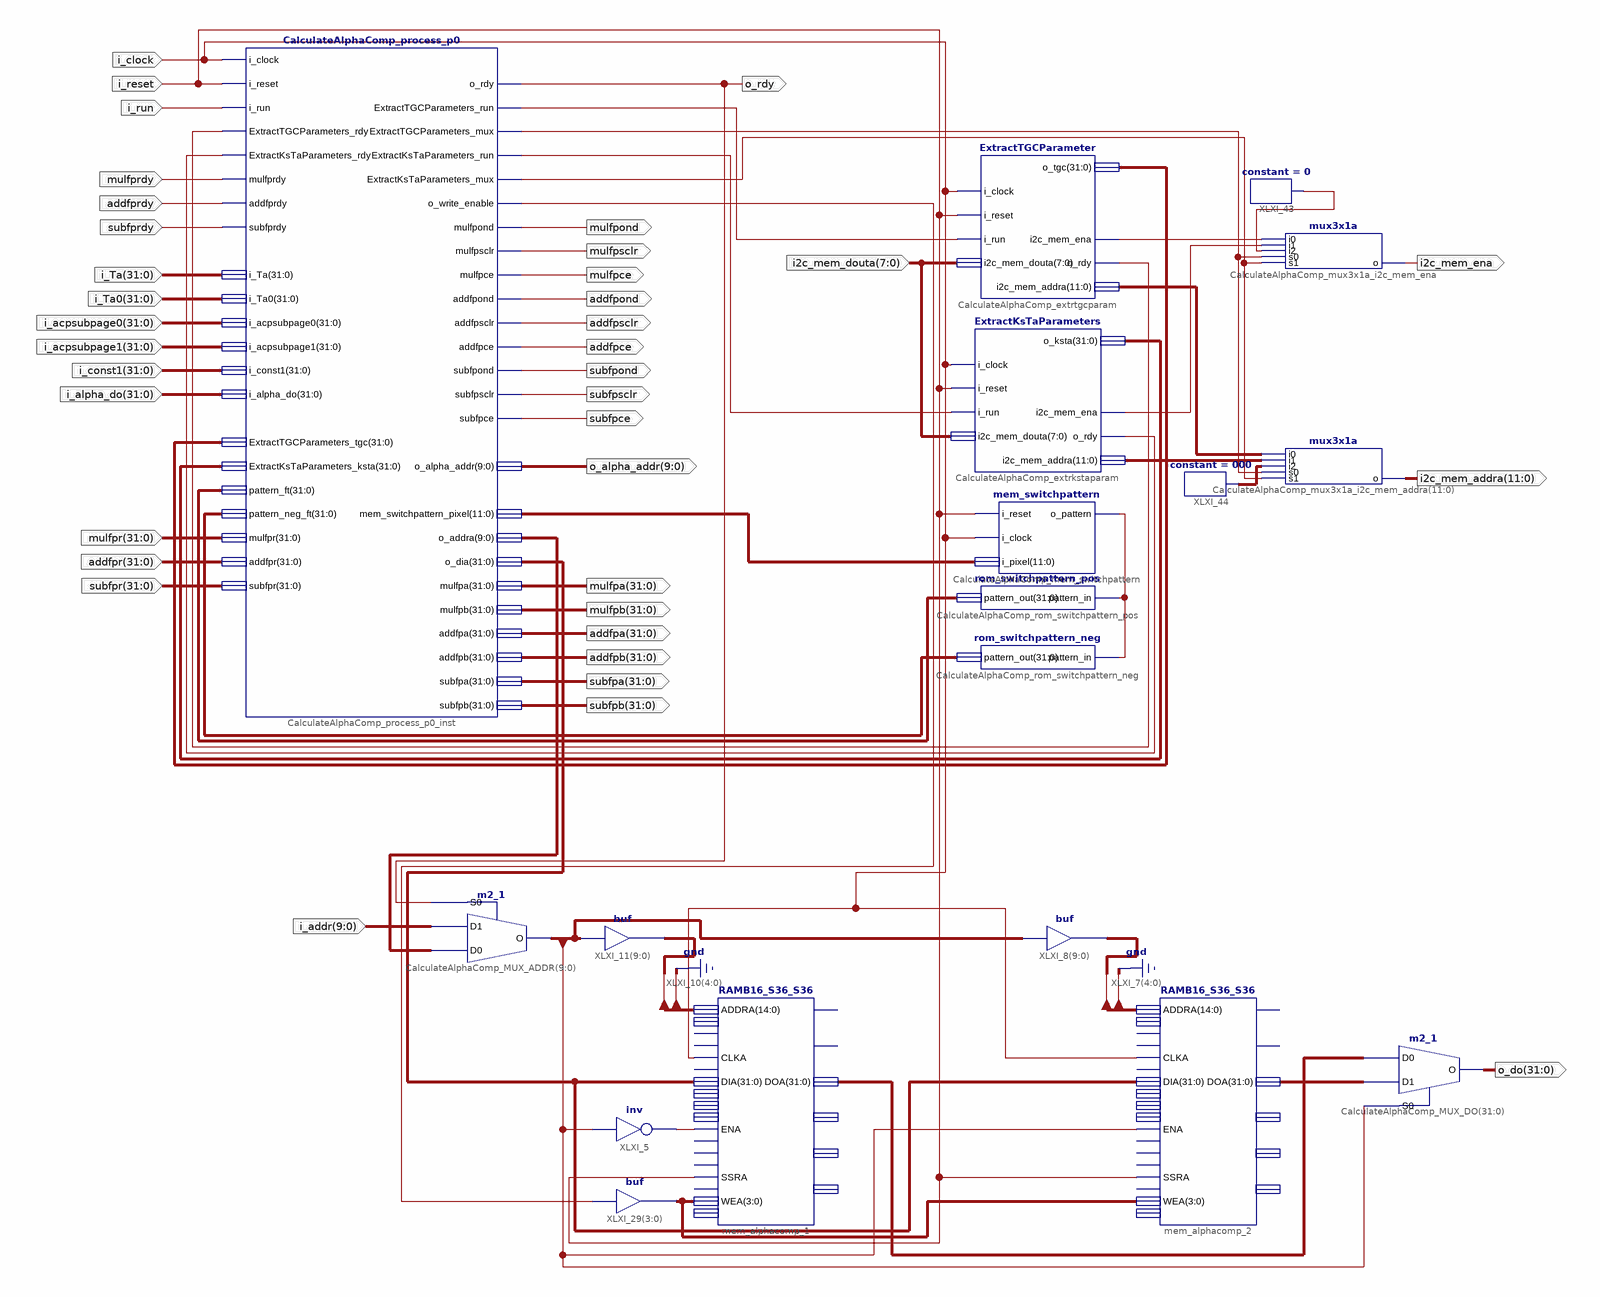
[diagram p0: schematic sheet 1]
// Xilinx ISE schematic CalculateAlphaComp.sch (spartan3e) as structural Verilog: 18 symbols, 37 ports
module CalculateAlphaComp (
  input  [9:0] i_addr,
  input  i_clock,
  input  i_reset,
  input  [7:0] i2c_mem_douta,
  input  i_run,
  input  mulfprdy,
  input  addfprdy,
  input  subfprdy,
  input  [31:0] i_Ta,
  input  [31:0] i_Ta0,
  input  [31:0] i_acpsubpage0,
  input  [31:0] i_acpsubpage1,
  input  [31:0] i_const1,
  input  [31:0] i_alpha_do,
  input  [31:0] mulfpr,
  input  [31:0] addfpr,
  input  [31:0] subfpr,
  output [31:0] o_do,
  output [11:0] i2c_mem_addra,
  output i2c_mem_ena,
  output o_rdy,
  output [31:0] subfpb,
  output [31:0] subfpa,
  output [31:0] addfpb,
  output [31:0] addfpa,
  output [31:0] mulfpb,
  output [31:0] mulfpa,
  output [9:0] o_alpha_addr,
  output subfpce,
  output subfpsclr,
  output subfpond,
  output addfpce,
  output addfpsclr,
  output addfpond,
  output mulfpce,
  output mulfpsclr,
  output mulfpond
);

  wire XLXN_59, XLXN_236, XLXN_242, XLXN_246, XLXN_247, XLXN_248, XLXN_249, XLXN_256, XLXN_257, XLXN_258,
       XLXN_259, XLXN_273;
  wire [3:0] XLXN_139;
  wire [9:0] mux_addr1, XLXN_241;
  wire [11:0] XLXN_243, XLXN_260, XLXN_261, XLXN_274;
  wire [14:5] XLXN_44, XLXN_45;
  wire [31:0] XLXN_78, XLXN_79, XLXN_239, XLXN_244, XLXN_245, XLXN_251, XLXN_253;

  assign XLXN_45 = mux_addr1;  // buf XLXI_8[9..0], 10 bits wide
  assign XLXN_44 = mux_addr1;  // buf XLXI_11[9..0], 10 bits wide
  not XLXI_5 (XLXN_59, mux_addr1[9]);
  RAMB16_S36_S36 #(.WRITE_WIDTH_B(36), .WRITE_WIDTH_A(36), .WRITE_MODE_B("READ_FIRST"), .WRITE_MODE_A("READ_FIRST"), .READ_WIDTH_B(36), .READ_WIDTH_A(36)) mem_alphacomp_1 (
    .ADDRA({XLXN_44, {5{1'b0}}}), .CLKA(i_clock), .DIA(XLXN_239), .ENA(XLXN_59), .SSRA(i_reset),
    .WEA(XLXN_139), .DOA(XLXN_79));  // open: ADDRB, CASCADEINA, CASCADEINB, CLKB, DIB, DIPA, DIPB, REGCEA, REGCEB, ENB, SSRB, WEB, CASCADEOUTA, CASCADEOUTB, DOB, DOPA, DOPB
  m2_1 CalculateAlphaComp_MUX_DO[31:0] (.D0(XLXN_79), .D1(XLXN_78), .S0(mux_addr1[9]), .O(o_do));
  assign XLXN_139 = {4{XLXN_236}};  // buf XLXI_29[3..0], 4 bits wide
  m2_1 CalculateAlphaComp_MUX_ADDR[9:0] (.D0(XLXN_241), .D1(i_addr), .S0(o_rdy), .O(mux_addr1));
  RAMB16_S36_S36 #(.WRITE_WIDTH_B(36), .WRITE_WIDTH_A(36), .WRITE_MODE_B("READ_FIRST"), .WRITE_MODE_A("READ_FIRST"), .READ_WIDTH_B(36), .READ_WIDTH_A(36)) mem_alphacomp_2 (
    .ADDRA({XLXN_45, {5{1'b0}}}), .CLKA(i_clock), .DIA(XLXN_239), .ENA(mux_addr1[9]), .SSRA(i_reset),
    .WEA(XLXN_139), .DOA(XLXN_78));  // open: ADDRB, CASCADEINA, CASCADEINB, CLKB, DIB, DIPA, DIPB, REGCEA, REGCEB, ENB, SSRB, WEB, CASCADEOUTA, CASCADEOUTB, DOB, DOPA, DOPB
  mem_switchpattern CalculateAlphaComp_mem_switchpattern (
    .i_reset(i_reset), .i_clock(i_clock), .i_pixel(XLXN_243), .o_pattern(XLXN_242));
  ExtractKsTaParameters CalculateAlphaComp_extrkstaparam (
    .i_clock(i_clock), .i_reset(i_reset), .o_ksta(XLXN_253), .i_run(XLXN_247), .i2c_mem_douta(i2c_mem_douta),
    .i2c_mem_ena(XLXN_257), .o_rdy(XLXN_249), .i2c_mem_addra(XLXN_260));
  ExtractTGCParameter CalculateAlphaComp_extrtgcparam (
    .i_clock(i_clock), .i_reset(i_reset), .o_tgc(XLXN_251), .i_run(XLXN_246), .i2c_mem_douta(i2c_mem_douta),
    .i2c_mem_ena(XLXN_256), .o_rdy(XLXN_248), .i2c_mem_addra(XLXN_261));
  rom_switchpattern_neg CalculateAlphaComp_rom_switchpattern_neg (.pattern_in(XLXN_242), .pattern_out(XLXN_245));
  rom_switchpattern_pos CalculateAlphaComp_rom_switchpattern_pos (.pattern_in(XLXN_242), .pattern_out(XLXN_244));
  CalculateAlphaComp_process_p0 CalculateAlphaComp_process_p0_inst (
    .i_clock(i_clock), .i_reset(i_reset), .i_run(i_run), .ExtractTGCParameters_rdy(XLXN_248),
    .ExtractKsTaParameters_rdy(XLXN_249), .mulfprdy(mulfprdy), .addfprdy(addfprdy), .subfprdy(subfprdy),
    .i_Ta(i_Ta), .i_Ta0(i_Ta0), .i_acpsubpage0(i_acpsubpage0), .i_acpsubpage1(i_acpsubpage1),
    .i_const1(i_const1), .i_alpha_do(i_alpha_do), .ExtractTGCParameters_tgc(XLXN_251),
    .ExtractKsTaParameters_ksta(XLXN_253), .pattern_ft(XLXN_244), .pattern_neg_ft(XLXN_245), .mulfpr(mulfpr),
    .addfpr(addfpr), .subfpr(subfpr), .o_rdy(o_rdy), .ExtractTGCParameters_run(XLXN_246),
    .ExtractTGCParameters_mux(XLXN_258), .ExtractKsTaParameters_run(XLXN_247),
    .ExtractKsTaParameters_mux(XLXN_259), .o_write_enable(XLXN_236), .mulfpond(mulfpond),
    .mulfpsclr(mulfpsclr), .mulfpce(mulfpce), .addfpond(addfpond), .addfpsclr(addfpsclr), .addfpce(addfpce),
    .subfpond(subfpond), .subfpsclr(subfpsclr), .subfpce(subfpce), .o_alpha_addr(o_alpha_addr),
    .mem_switchpattern_pixel(XLXN_243), .o_addra(XLXN_241), .o_dia(XLXN_239), .mulfpa(mulfpa),
    .mulfpb(mulfpb), .addfpa(addfpa), .addfpb(addfpb), .subfpa(subfpa), .subfpb(subfpb));
  mux3x1a CalculateAlphaComp_mux3x1a_i2c_mem_ena (
    .s1(XLXN_259), .s0(XLXN_258), .i2(XLXN_273), .i1(XLXN_257), .i0(XLXN_256), .o(i2c_mem_ena));
  mux3x1a CalculateAlphaComp_mux3x1a_i2c_mem_addra[11:0] (
    .s1(XLXN_259), .s0(XLXN_258), .i2(XLXN_274), .i1(XLXN_260), .i0(XLXN_261), .o(i2c_mem_addra));
  constant #(.CValue("0")) XLXI_43 (.O(XLXN_273));
  constant #(.CValue("000")) XLXI_44 (.O(XLXN_274));
endmodule
